# EAGLE board mainboard_eurobotics2010_r5 (EAGLE 4.16)
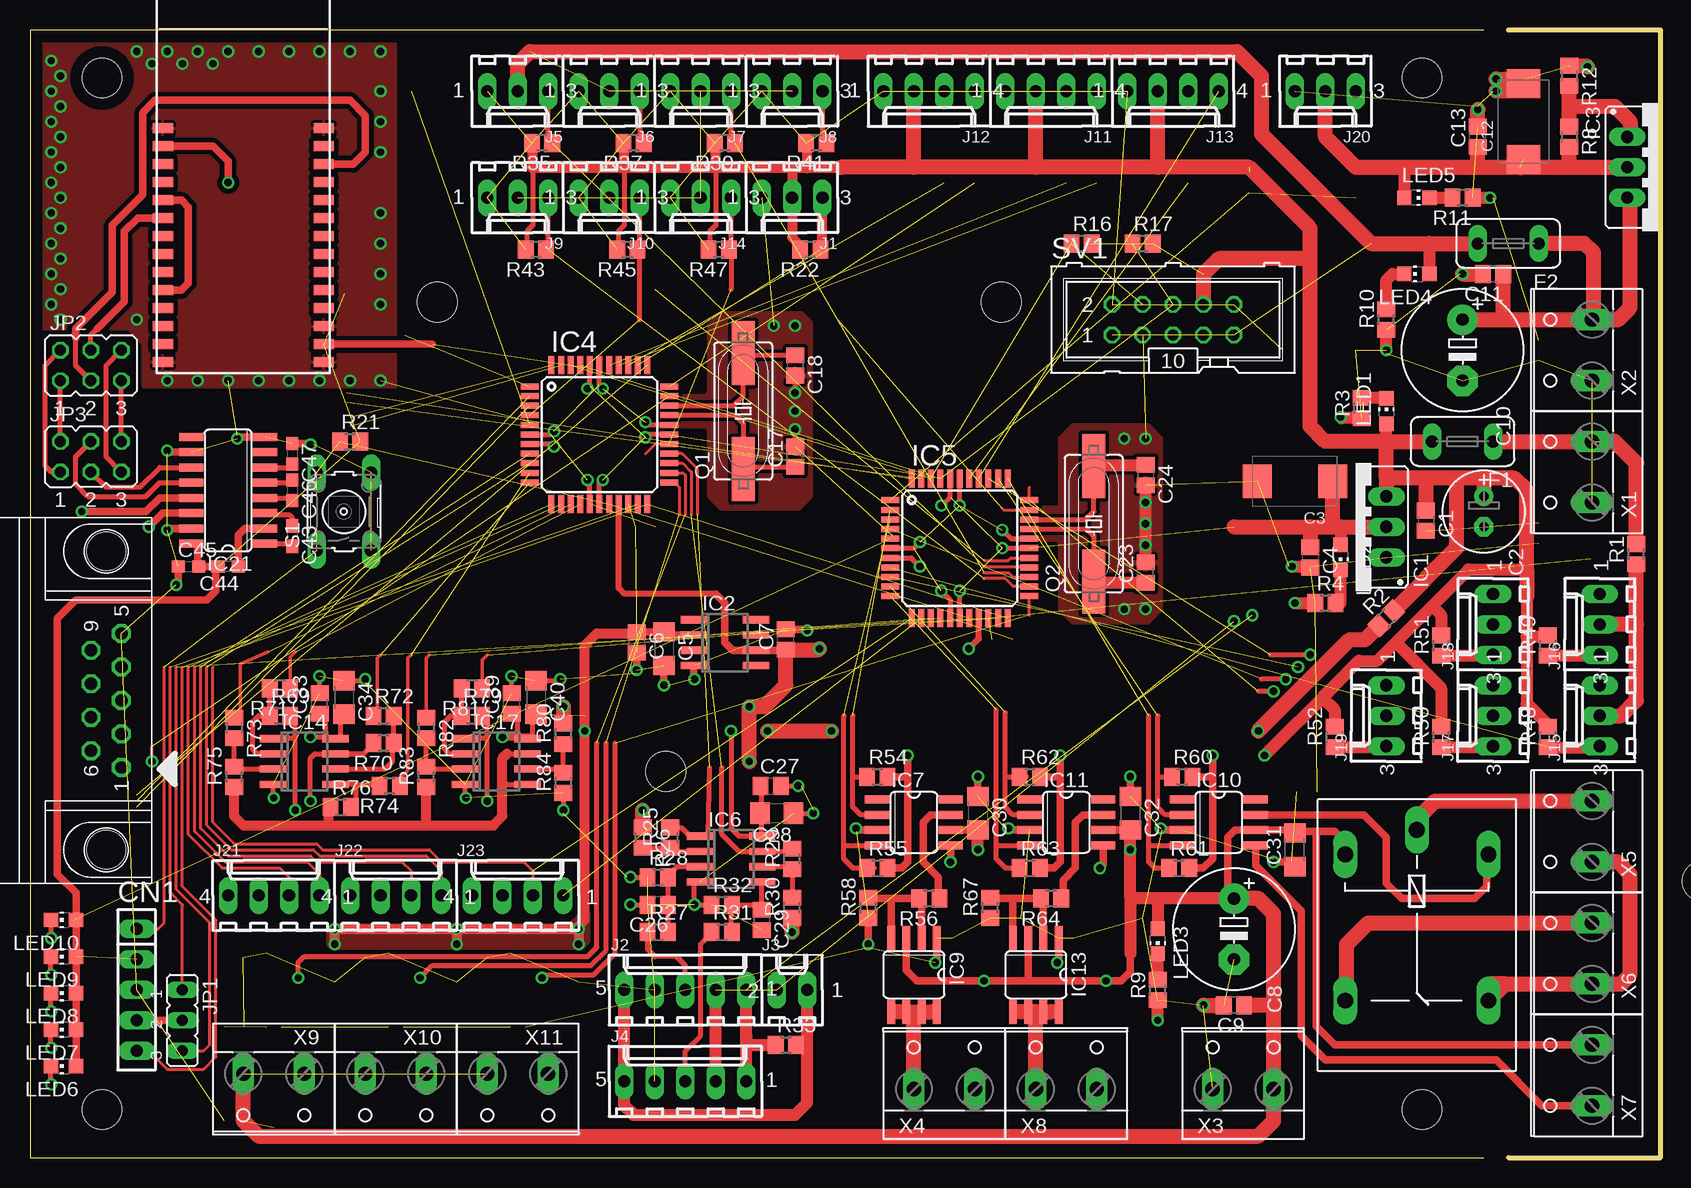
[diagram p9: board, top side]
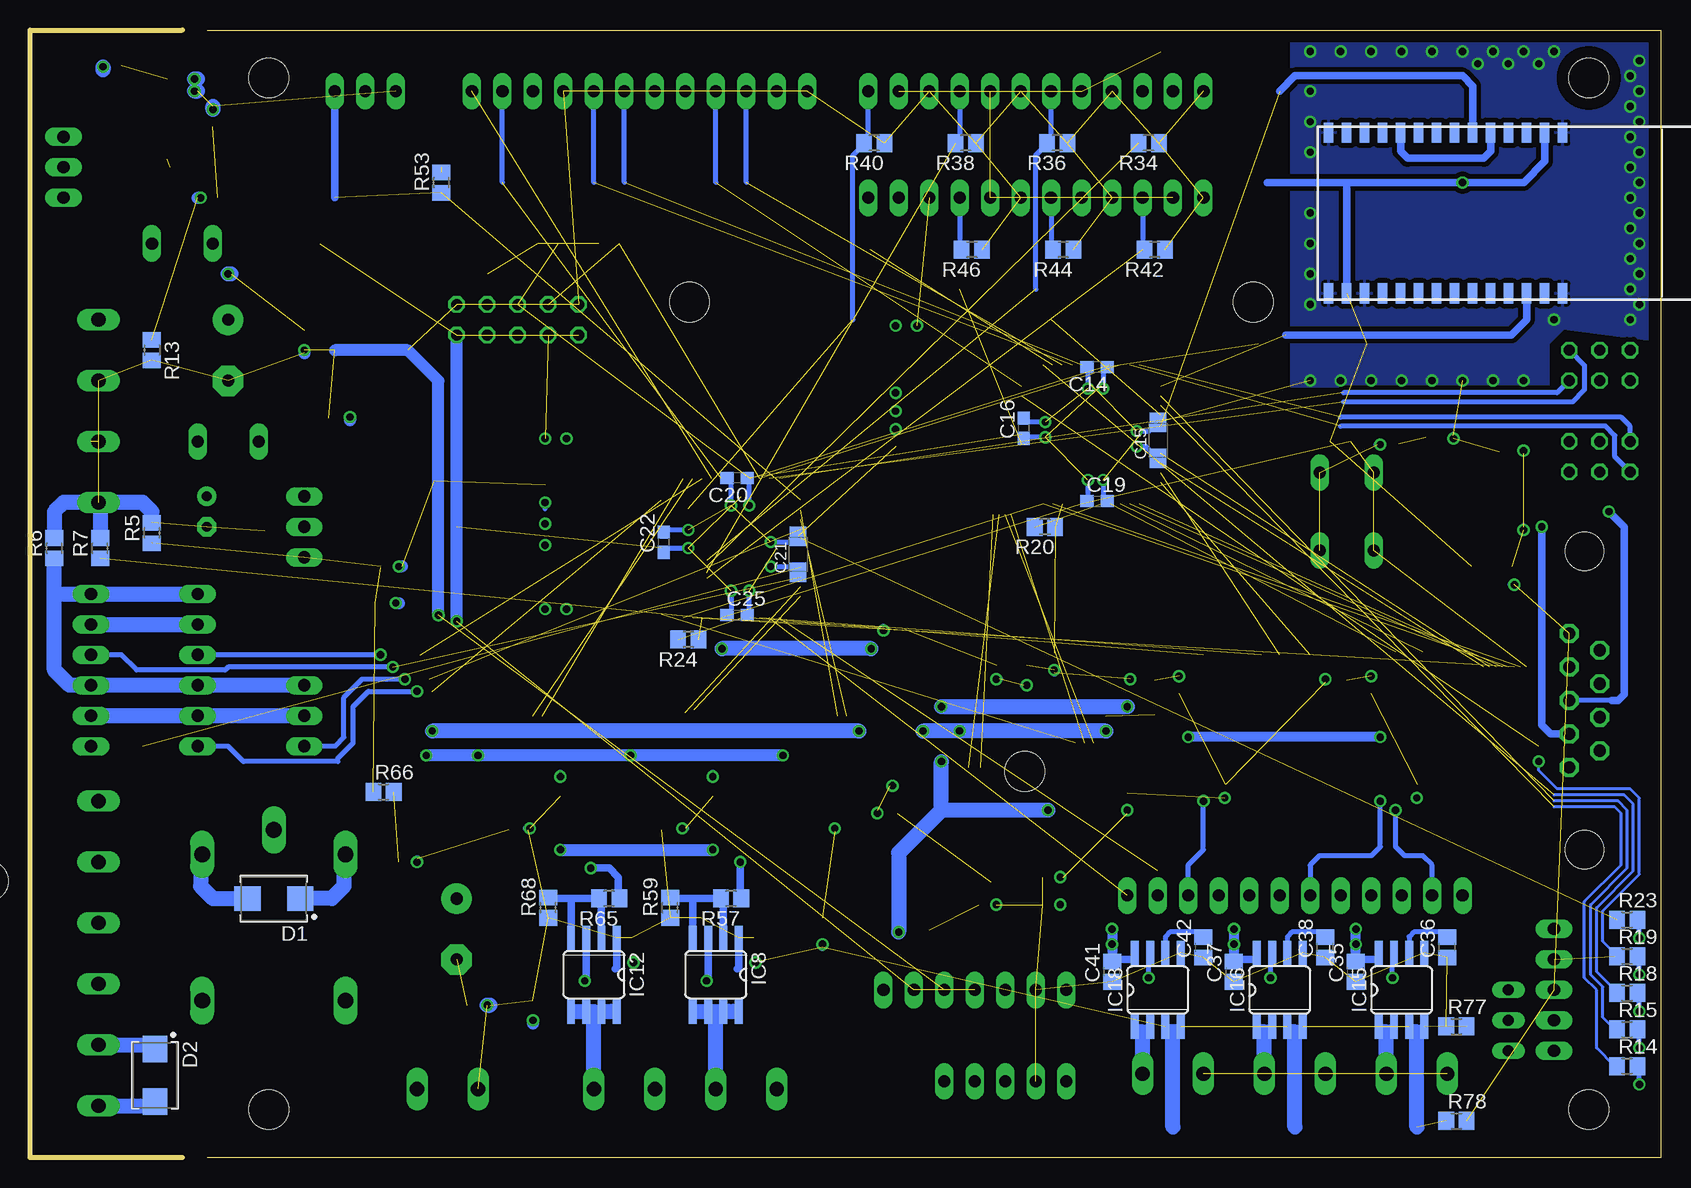
[diagram p10: board, bottom side, seen from below]

Size 135.89 x 94 mm. Coordinates in mm from the lower left corner, seen from the top.
Outline: 121.13,0 0,0 0,94 121.13,94
Outline: 123.19,0 135.89,0 135.89,93.98 123.19,93.98
Copper layers (1*16): Top 0.035mm / dielectric 1.5mm / Bottom 0.035mm
Design rules "olimex": minimum track width 10mil, minimum drill 24mil, track to track 8mil, track to pad 8mil, pad to pad 8mil, via to via 8mil, smd to smd 8mil, copper to edge 40mil, drill to drill 8mil, minimum pad ring 8mil, minimum via ring 8mil, stop-mask expansion 4mil, vias tented up to drill 0mil, thermal gap 10mil
Holes 3.3 mm at 6,4 116,4 6,90 116,90 80.93,71.31 33.94,71.31 52.99,32.19 139.35,23.05

## Footprints (pad centres in the part's own frame; a part is rotated, then mirrored left to right if it is on the bottom)
C0805 = smd 1.3 x 1.5: 1 -0.85,0; 2 0.85,0
E2,5-7 = drill 0.813 pad 1.6 round: + -1.27,0 | drill 0.813 pad 1.6 octagon: - 1.27,0
SMC_D = smd 2.4 x 2.8: + -3.15,0; - 3.15,0
C1206 = smd 1.6 x 1.8: 1 -1.4,0; 2 1.4,0
E5-10,5 = drill 1.016 pad 2.54 round: + -2.54,0 | drill 1.016 pad 2.54 octagon: - 2.54,0
C0603 = smd 1.1 x 1: 1 -0.85,0; 2 0.85,0
SMC_A = smd 1.6 x 1.4: + -1.5,0; - 1.5,0
SIP-100-5V = drill 1.016 long: 1 -5.08,0; 2 -2.54,0; 3 0,0; 4 2.54,0; 5 5.08,0
D-09F/90 = drill 1.016 pad 1.575 octagon: 1 -5.588,-1.27; 2 -2.794,-1.27; 3 0,-1.27; 4 2.794,-1.27; 5 5.588,-1.27; 6 -4.191,1.27; 7 -1.397,1.27; 8 1.397,1.27; 9 4.191,1.27 | hole 3.2: 12.446,0; -12.446,0
DIOM5436X265N = smd 2.2 x 2.05: A 2.2,0; K -2.2,0
TE5 = drill 1.016 long: 1 -2.54,0; 2 2.54,0
317TS = drill 1.016 long: 1 -2.54,-2.54; 2 0,-2.54; 3 2.54,-2.54
SOIC8 = smd 0.6 x 2.2: 1 -1.905,-2.6; 2 -0.635,-2.6; 3 0.635,-2.6; 4 1.905,-2.6; 5 1.905,2.6; 6 0.635,2.6; 7 -0.635,2.6; 8 -1.905,2.6
TQFP44 = smd 1.5 x 0.5: 1 -5.8,4; 2 -5.8,3.2; 3 -5.8,2.4; 4 -5.8,1.6; 5 -5.8,0.8; 6 -5.8,0; 7 -5.8,-0.8; 8 -5.8,-1.6; 9 -5.8,-2.4; 10 -5.8,-3.2; 11 -5.8,-4; 23 5.8,-4; 24 5.8,-3.2; 25 5.8,-2.4; 26 5.8,-1.6; 27 5.8,-0.8; 28 5.8,0; 29 5.8,0.8; 30 5.8,1.6; 31 5.8,2.4; 32 5.8,3.2; 33 5.8,4 | smd 0.5 x 1.5: 12 -4,-5.8; 13 -3.2,-5.8; 14 -2.4,-5.8; 15 -1.6,-5.8; 16 -0.8,-5.8; 17 0,-5.8; 18 0.8,-5.8; 19 1.6,-5.8; 20 2.4,-5.8; 21 3.2,-5.8; 22 4,-5.8; 34 4,5.8; 35 3.2,5.8; 36 2.4,5.8; 37 1.6,5.8; 38 0.8,5.8; 39 0,5.8; 40 -0.8,5.8; 41 -1.6,5.8; 42 -2.4,5.8; 43 -3.2,5.8; 44 -4,5.8
SO08 = smd 0.6 x 2.2: 1 -1.905,-2.6; 2 -0.635,-2.6; 3 0.635,-2.6; 4 1.905,-2.6; 5 1.905,2.6; 6 0.635,2.6; 7 -0.635,2.6; 8 -1.905,2.6
SO08' = smd 0.66 x 2.032: 1 -1.905,-3.073; 2 -0.635,-3.073; 3 0.635,-3.073; 4 1.905,-3.073; 5 1.905,3.073; 6 0.635,3.073; 7 -0.635,3.073; 8 -1.905,3.073
WT11 = smd 1.7 x 0.8: 1 -6.7,2.5; 2 -6.7,1; 3 -6.7,-0.5; 4 -6.7,-2; 5 -6.7,-3.5; 6 -6.7,-5; 7 -6.7,-6.5; 8 -6.7,-8; 9 -6.7,-9.5; 10 -6.7,-11; 11 -6.7,-12.5; 12 -6.7,-14; 13 -6.7,-15.5; 14 -6.7,-17; 15 6.7,-17; 16 6.7,-15.5; 17 6.7,-14; 18 6.7,-12.5; 19 6.7,-11; 20 6.7,-9.5; 21 6.7,-8; 22 6.7,-6.5; 23 6.7,-5; 24 6.7,-3.5; 25 6.7,-2; 26 6.7,-0.5; 27 6.7,1; 28 6.7,2.5
SO16 = smd 0.66 x 2.032: 1 -4.445,-3.073; 2 -3.175,-3.073; 3 -1.905,-3.073; 4 -0.635,-3.073; 5 0.635,-3.073; 6 1.905,-3.073; 7 3.175,-3.073; 8 4.445,-3.073; 9 4.445,3.073; 10 3.175,3.073; 11 1.905,3.073; 12 0.635,3.073; 13 -0.635,3.073; 14 -1.905,3.073; 15 -3.175,3.073; 16 -4.445,3.073
6410-03 = drill 1.016 long: 1 2.54,0; 2 0,0; 3 -2.54,0
6410-05 = drill 1.016 long: 1 5.08,0; 2 2.54,0; 3 0,0; 4 -2.54,0; 5 -5.08,0
6410-02 = drill 1.016 long: 1 1.27,0; 2 -1.27,0
6410-04 = drill 1.016 long: 1 3.81,0; 2 1.27,0; 3 -1.27,0; 4 -3.81,0
JP2 = drill 0.914 long: 1 -2.54,0; 2 0,0; 3 2.54,0
JP3Q = drill 0.914 octagon: 1 -2.54,-1.27; 2 -2.54,1.27; 3 0,-1.27; 4 0,1.27; 5 2.54,-1.27; 6 2.54,1.27
G5LE = drill 1.321 long: 1 -7.493,-5.969; 2 -7.493,5.969; O 4.699,5.969; P -9.525,0; S 4.699,-5.969
CHIP-LED0805 = smd 1.2 x 1.2: A 0,-1.05; C 0,1.05
HC49UP = smd 5.334 x 1.93: 1 -4.826,0; 2 4.826,0
R0805 = smd 1.3 x 1.5: 1 -0.85,0; 2 0.85,0
B3F-10XX = drill 1.016 long: 1 -3.251,2.261; 2 3.251,2.261; 3 -3.251,-2.261; 4 3.251,-2.261
ML10 = drill 0.914 octagon: 1 -5.08,-1.27; 2 -5.08,1.27; 3 -2.54,-1.27; 4 -2.54,1.27; 5 0,-1.27; 6 0,1.27; 7 2.54,-1.27; 8 2.54,1.27; 9 5.08,-1.27; 10 5.08,1.27
W237-132 = drill 1.194 long: 1 -2.54,-0.635; 2 2.54,-0.635

## Placement (x,y rotation side)
C1  100nF  [C0805]  116.33,53.09 270 top
C2  220uF/10V  [E2,5-7]  121.16,53.85 270 top
C3  47uF/6V  [SMC_D]  105.41,56.39 180 top
C4  100nF  [C0805]  106.68,50.04 270 top
C5  10uF/10V  [C1206]  52.83,42.42 270 top
C6  100nF  [C0805]  50.55,42.93 270 top
C7  100nF  [C0805]  62.99,43.18 90 top
C8  220uF/35V  [E5-10,5]  100.33,19.05 270 top
C9  100nF  [C0805]  100.33,12.7 180 top
C10  220uF/35V  [E5-10,5]  119.38,67.31 270 top
C11  100nF  [C0805]  121.92,73.66 180 top
C12  47uF/16V  [SMC_D]  124.46,86.36 90 top
C13  100nF  [C0805]  120.65,85.09 90 top
C14  100nF  [C0603]  46.96,65.89 180 bottom
C15  10uF/6V/lowESR  [SMC_A]  41.88,59.79 90 bottom
C16  100nF  [C0603]  53.06,60.81 90 bottom
C17  22pF  [C0805]  63.75,58.42 90 top
C18  22pF  [C0805]  63.75,66.04 270 top
C19  100nF  [C0603]  46.96,54.71 0 bottom
C20  100nF  [C0603]  76.96,56.64 180 bottom
C21  10uF/6V/lowESR  [SMC_A]  71.88,50.29 90 bottom
C22  100nF  [C0603]  83.06,51.31 90 bottom
C23  22pF  [C0805]  92.96,48.77 90 top
C24  22pF  [C0805]  92.96,56.9 270 top
C25  100nF  [C0603]  76.96,45.21 0 bottom
C26  C1  [C0805]  52.32,21.08 180 top
C27  100nF  [C0805]  61.72,30.99 0 top
C28  10uF/10V  [C1206]  62.23,28.7 180 top
C29  C1  [C0805]  60.96,19.81 270 top
C30  10uF/35V  [C1206]  78.99,28.7 270 top
C31  10uF/35V  [C1206]  105.41,25.65 90 top
C32  10uF/35V  [C1206]  91.69,28.7 270 top
C33  100nF  [C0805]  24.13,37.85 90 top
C34  10uF/10V  [C1206]  26.16,38.35 270 top
C35  100nF  [C0805]  25.4,15.49 90 bottom
C36  100nF  [C0805]  17.78,17.53 90 bottom
C37  100nF  [C0805]  35.56,15.49 90 bottom
C38  100nF  [C0805]  27.94,17.53 90 bottom
C39  100nF  [C0805]  40.13,37.85 90 top
C40  10uF/10V  [C1206]  42.16,38.35 270 top
C41  100nF  [C0805]  45.72,15.49 90 bottom
C42  100nF  [C0805]  38.1,17.53 90 bottom
C43  100nF  [C0603]  21.84,51.82 270 top
C44  100nF  [C0603]  16.51,49.28 180 top
C45  100nF  [C0603]  13.21,49.28 0 top
C46  100nF  [C0603]  21.84,55.63 270 top
C47  100nF  [C0603]  21.84,58.67 270 top
CN1  [SIP-100-5V]  8.89,13.97 270 top
CON1  [D-09F/90]  6.35,38.1 90 top
D1  SS24  [DIOM5436X265N]  115.57,21.59 180 bottom
D2  SS24  [DIOM5436X265N]  125.48,6.86 270 bottom
F1  FUSETE5  [TE5]  119.38,59.69 180 top
F2  FUSETE5  [TE5]  123.19,76.2 180 top
IC1  LM1086CT-3.3  [317TS]  110.49,52.58 90 top
IC2  ADR443BRZ-R-8  [SOIC8]  57.91,42.93 270 top
IC3  LM338T  [317TS]  135.64,82.55 270 top
IC4  DSPIC33FJXXMC804SMD  [TQFP44]  47.45,60.28 0 top
IC5  DSPIC33FJXXMC804SMD  [TQFP44]  77.47,50.8 0 top
IC6  MCP6022SN  [SO08]  58.42,24.89 270 top
IC7  TC4427  [SO08']  73.66,27.94 270 top
IC8  IRF7389  [SO08']  78.74,15.24 180 bottom
IC9  IRF7389  [SO08']  73.66,15.24 180 top
IC10  TC4427  [SO08']  99.06,27.94 270 top
IC11  TC4427  [SO08']  86.36,27.94 270 top
IC12  IRF7389  [SO08']  88.9,15.24 180 bottom
IC13  IRF7389  [SO08']  83.82,15.24 180 top
IC14  MCP6022SN  [SO08]  22.86,33.02 270 top
IC15  ADS713  [SO08']  21.59,13.97 0 bottom
IC16  ADS713  [SO08']  31.75,13.97 0 bottom
IC17  MCP6022SN  [SO08]  38.86,33.02 270 top
IC18  ADS713  [SO08']  41.91,13.97 0 bottom
IC19  WT11A  [WT11]  17.78,83.31 0 top
IC20  WT11A  [WT11]  10.67,78.74 270 bottom
IC21  MAX232ACSE  [SO16]  16.51,55.63 90 top
J1  [6410-03]  63.5,80.01 180 top
J2  [6410-05]  54.61,13.97 0 top
J3  [6410-02]  63.5,13.97 0 top
J4  [6410-05]  54.61,6.35 0 top
J5  [6410-03]  40.64,88.9 180 top
J6  [6410-03]  48.26,88.9 180 top
J7  [6410-03]  55.88,88.9 180 top
J8  [6410-03]  63.5,88.9 180 top
J9  [6410-03]  40.64,80.01 180 top
J10  [6410-03]  48.26,80.01 180 top
J11  [6410-04]  85.09,88.9 180 top
J12  [6410-04]  74.93,88.9 180 top
J13  [6410-04]  95.25,88.9 180 top
J14  [6410-03]  55.88,80.01 180 top
J15  [6410-03]  130.81,36.83 90 top
J16  [6410-03]  130.81,44.45 90 top
J17  [6410-03]  121.92,36.83 90 top
J18  [6410-03]  121.92,44.45 90 top
J19  [6410-03]  113.03,36.83 90 top
J20  [6410-03]  107.95,88.9 180 top
J21  [6410-04]  20.32,21.84 0 top
J22  [6410-04]  30.48,21.84 0 top
J23  [6410-04]  40.64,21.84 0 top
JP1  [JP2]  12.7,11.43 270 top
JP2  [JP3Q]  5.08,66.04 0 top
JP3  [JP3Q]  5.08,58.42 0 top
K1  G5LE  [G5LE]  115.57,17.78 270 top
LED1  [CHIP-LED0805]  113.03,62.23 0 top
LED2  [CHIP-LED0805]  109.22,50.04 180 top
LED3  [CHIP-LED0805]  93.98,18.03 180 top
LED4  [CHIP-LED0805]  115.57,73.66 90 top
LED5  [CHIP-LED0805]  115.57,80.01 270 top
LED6  [CHIP-LED0805]  2.79,7.62 90 top
LED7  [CHIP-LED0805]  2.79,10.67 90 top
LED8  [CHIP-LED0805]  2.79,13.72 90 top
LED9  [CHIP-LED0805]  2.79,16.76 90 top
LED10  [CHIP-LED0805]  2.79,19.81 90 top
Q1  10MHz  [HC49UP]  59.44,62.23 90 top
Q2  10MHz  [HC49UP]  88.65,52.83 90 top
R1  0R  [R0805]  133.86,50.29 90 top
R2  0R  [R0805]  113.03,44.96 45 top
R3  470R  [R0805]  111,62.48 90 top
R4  270R  [R0805]  107.95,46.23 0 top
R5  0R  [R0805]  125.73,52.07 90 bottom
R6  0R  [R0805]  133.86,50.8 90 bottom
R7  0R  [R0805]  130.05,50.8 90 bottom
R8  240R/1%  [R0805]  128.27,85.09 270 top
R9  2K7  [R0805]  93.98,13.97 90 top
R10  1K  [R0805]  113.03,69.85 90 top
R11  1K  [R0805]  119.38,80.01 180 top
R12  1K6/1%  [R0805]  128.27,90.17 270 top
R13  0R  [R0805]  125.73,67.31 270 bottom
R14  270R  [R0805]  2.79,7.62 0 bottom
R15  270R  [R0805]  2.79,10.67 0 bottom
R16  4K7  [R0805]  87.63,76.2 0 top
R17  4K7  [R0805]  92.71,76.2 0 top
R18  270R  [R0805]  2.79,13.72 0 bottom
R19  270R  [R0805]  2.79,16.76 0 bottom
R20  0R  [R0805]  51.31,52.58 180 bottom
R21  10K  [R0805]  26.67,59.69 0 top
R22  4K7  [R0805]  65.02,75.69 180 top
R23  270R  [R0805]  2.79,19.81 0 bottom
R24  0R  [R0805]  81.03,43.18 180 bottom
R25  RD  [R0805]  53.34,26.67 90 top
R26  RC  [R0805]  51.05,26.67 270 top
R27  RA  [R0805]  52.32,18.8 0 top
R28  RB  [R0805]  52.32,23.37 0 top
R29  RD  [R0805]  63.5,24.89 90 top
R30  RC  [R0805]  63.5,20.83 90 top
R31  RA  [R0805]  57.66,18.8 0 top
R32  RB  [R0805]  57.66,21.08 0 top
R33  10K  [R0805]  62.99,9.4 0 top
R34  4K7  [R0805]  42.67,84.58 180 bottom
R35  4K7  [R0805]  42.67,84.58 180 top
R36  4K7  [R0805]  50.29,84.58 180 bottom
R37  4K7  [R0805]  50.29,84.58 180 top
R38  4K7  [R0805]  57.91,84.58 180 bottom
R39  4K7  [R0805]  57.91,84.58 180 top
R40  4K7  [R0805]  65.53,84.58 180 bottom
R41  4K7  [R0805]  65.53,84.58 180 top
R42  4K7  [R0805]  42.16,75.69 180 bottom
R43  4K7  [R0805]  42.16,75.69 180 top
R44  4K7  [R0805]  49.78,75.69 180 bottom
R45  4K7  [R0805]  49.78,75.69 180 top
R46  4K7  [R0805]  57.4,75.69 180 bottom
R47  4K7  [R0805]  57.4,75.69 180 top
R48  4K7  [R0805]  126.49,35.05 90 top
R49  4K7  [R0805]  126.49,42.67 90 top
R50  4K7  [R0805]  117.6,35.05 90 top
R51  4K7  [R0805]  117.6,42.67 90 top
R52  4K7  [R0805]  108.71,35.05 90 top
R53  4K7  [R0805]  101.6,81.28 90 bottom
R54  2K2  [R0805]  70.61,31.75 0 top
R55  2K2  [R0805]  70.61,24.13 0 top
R56  22R  [R0805]  74.93,21.59 180 top
R57  22R  [R0805]  77.47,21.59 180 bottom
R58  2K2  [R0805]  69.85,20.83 90 top
R59  2K2  [R0805]  82.55,20.83 90 bottom
R60  2K2  [R0805]  96.01,31.75 0 top
R61  2K2  [R0805]  95.76,24.13 0 top
R62  2K2  [R0805]  83.31,31.75 0 top
R63  2K2  [R0805]  83.31,24.13 0 top
R64  22R  [R0805]  85.09,21.59 180 top
R65  22R  [R0805]  87.63,21.59 180 bottom
R66  0R  [R0805]  106.43,30.48 0 bottom
R67  2K2  [R0805]  80.01,20.83 90 top
R68  2K2  [R0805]  92.71,20.83 90 bottom
R69  2K/1%  [R0805]  20.83,36.83 0 top
R70  2K/1%  [R0805]  29.46,34.54 180 top
R71  1K/1%  [R0805]  20.83,39.12 180 top
R72  1K/1%  [R0805]  29.46,36.83 0 top
R73  1K/1%  [R0805]  17.02,35.81 270 top
R74  1K/1%  [R0805]  29.97,30.99 180 top
R75  2K/1%  [R0805]  17.02,31.75 90 top
R76  2K/1%  [R0805]  25.91,29.21 0 top
R77  0R  [R0805]  17.02,10.92 0 bottom
R78  0R  [R0805]  17.02,3.05 0 bottom
R79  2K/1%  [R0805]  36.83,36.83 0 top
R80  1K/1%  [R0805]  44.45,35.31 90 top
R81  1K/1%  [R0805]  36.83,39.12 180 top
R82  1K/1%  [R0805]  33.02,35.81 270 top
R83  2K/1%  [R0805]  33.02,31.75 90 top
R84  2K/1%  [R0805]  44.45,31.24 90 top
S1  [B3F-10XX]  26.16,53.85 90 top
SV1  [ML10]  95.25,69.85 0 top
X1  [W237-132]  129.54,57.15 90 top
X2  [W237-132]  129.54,67.31 90 top
X3  [W237-132]  101.09,6.35 0 top
X4  [W237-132]  76.2,6.35 0 top
X5  [W237-132]  129.54,27.18 90 top
X6  [W237-132]  129.54,17.02 90 top
X7  [W237-132]  129.54,6.86 90 top
X8  [W237-132]  86.36,6.35 0 top
X9  [W237-132]  20.32,6.35 180 top
X10  [W237-132]  30.48,6.35 180 top
X11  [W237-132]  40.64,6.35 180 top

## Tracks (layer width: path | path; a pad name or v marks a point on that pad's centre or on a via)
0V  (via drill 0.61)  (23 unrouted)
  Top 0.406: 68.96,27.3 v68.83,27.43
  Top 0.61: IC10.3 94.36,27.3 v94.23,27.43 | IC9.1 75.56,16.38 v75.44,16.26 | v69.85,17.78 R58.1 | C31.1 105.41,24.38 105.16,24.64 v103.63,24.64 | C32.1 v91.69,31.75 | IC13.1 85.72,16.38 v85.6,16.26 | C30.1 v78.99,31.75 | IC11.3 81.41,27.3 v81.53,27.43 | IC7.3 68.96,27.3
  Top 1.016: v93.98,11.43 R9.1
  Top 1.27: v97.79,12.7 C9.2
  Bottom 0.406: IC15.4 19.79,10.9 19.81,10.92 19.84,10.9 IC15.3 20.34,10.9 20.32,10.92 20.32,10.16 | IC18.3 40.16,10.9 40.13,10.92 40.11,10.9 IC18.4 40.62,10.9 40.64,10.92 40.64,10.16 | IC16.4 30.96,10.9 30.99,10.92 31.01,10.9 IC16.3 30.5,10.9 30.48,10.92 30.48,10.16 | v68.83,27.43 68.83,27.18
  Bottom 0.61: v94.23,27.43 94.49,27.43 | IC8.1 76.83,15.88 76.96,15.75 | 69.85,17.53 v69.85,17.78 | v103.63,24.64 103.63,24.89 | v91.69,31.75 91.69,32 | IC12.1 87,15.88 87.12,15.75 | v78.99,31.75 78.99,32 | v81.53,27.43 81.28,27.43
  Bottom 1.016: v93.98,11.43 93.98,11.18
  Bottom 1.27: v97.79,12.7 97.54,12.7 | 20.32,2.54 20.32,10.16 | 40.64,2.54 40.64,10.16 | 30.48,2.54 30.48,10.16
+3V3  (via drill 0.61)  (11 unrouted)
  Top 0.254: 3.84,22.06 3.81,22.1
  Top 0.305: LED7.A 3.81,10.67 3.84,10.63 | LED8.A 3.81,13.72 3.84,13.68 | LED9.A 3.81,16.76 3.84,16.73 | LED10.A 3.81,19.81 3.84,19.78
  Top 0.406: 77.47,44.96 IC5.17 v77.47,47.24 | v81.03,50.8 IC5.28 | IC5.40 76.67,55.08 v75.95,54.36 | IC4.17 47.45,56.22 v47.72,56.49 | IC4.28 51.55,60.28 v51.28,60.04 | IC4.40 46.65,64.31 v46.45,64.11
  Top 0.61: 13.97,49.28 C45.2 | IC21.16 13.97,51.18 13.97,49.28 | 13.97,49.28 C44.2 15.75,49.28 15.49,49.02 15.49,47.24 14.73,46.48 3.81,46.48 2.29,44.96 2.29,23.62 3.81,22.1 | LED6.A 3.84,10.63 | LED7.A 3.84,13.68 | LED8.A 3.84,16.73 | LED9.A 3.84,19.78 | LED10.A 3.84,22.06 | IC19.2 15.26,84.31 16.51,83.06 v16.51,81.28 | IC19.16 33.52,67.81 33.53,67.82
  Top 1.016: 109.22,52.58 LED2.A
  Top 1.27: 100.33,52.58 106.68,52.58 | 106.68,52.58 108.46,52.58 | 108.46,52.58 109.22,52.58 IC1.2 | C3.+ 108.56,52.68 108.46,52.58 | 106.68,52.58 C4.1
  Bottom 0.254: 47.72,54.71 C19.1 | 53.06,60.04 C16.1
  Bottom 0.406: C25.1 77.47,45.21 v77.47,47.24 | C22.1 83.06,50.8 v81.03,50.8 | C20.1 75.95,56.64 v75.95,54.36 | v47.72,56.49 47.72,54.71 | v51.28,60.04 53.06,60.04 | C14.1 46.2,65.89 46.45,65.63 v46.45,64.11
  Bottom 0.61: 26.16,81.28 v16.51,81.28 11.43,81.28 9.67,83.04 IC20.2 | 26.16,81.28 32.77,81.28 | IC20.16 26.17,81.27 26.16,81.28
+3V_VREF  (via drill 0.61)
  Top 0.508: IC5.19 79.07,43.26 v78.23,42.42 | IC4.19 49.05,47.47 49.53,46.99 57.15,46.99
  Top 0.61: C7.1 62.99,42.16 62.87,42.29 IC2.6 58.55,42.29 57.91,42.93 57.91,46.23 57.15,46.99
  Top 1.27: 62.99,42.16 62.99,39.37 61.21,37.59 v59.94,37.59 v59.94,33.02 | v63.5,18.8 R30.1 | R26.1 v51.05,28.96 | v44.45,37.59 R80.2 | C7.1 65.7,42.33 v65.79,42.42
  Bottom 1.27: v63.5,18.8 63.5,25.4 59.94,28.96 | v51.05,28.96 59.94,28.96 | 59.94,28.96 v59.94,33.02 | v59.94,37.59 v44.45,37.59 | v65.79,42.42 v78.23,42.42
+5V  (via drill 0.61)  (3 unrouted)
  Top 0.406: 41.91,82.55 41.91,77.72 41.4,77.22 41.4,75.69 R43.2 | 49.53,82.55 49.53,77.72 49.02,77.22 49.02,75.69 R45.2 | 57.15,82.55 57.15,77.72 56.64,77.22 56.64,75.69 R47.2
  Top 0.61: R61.2 97.79,24.13 98.55,24.89 98.55,31.75 | 98.55,31.75 R60.2 | 71.88,31.75 R54.2 73.15,31.75 | 85.85,31.75 R62.2 | 73.15,31.75 v73.15,33.53 | v85.85,33.53 85.85,31.75 | v98.55,33.53 98.55,31.75 | R63.2 85.34,24.13 85.85,24.64 85.85,31.75 | R55.2 72.64,24.13 73.15,24.64 73.15,31.75
  Top 0.813: 41.91,82.55 41.91,84.58 | 49.53,82.55 49.53,84.58 | 64.77,82.55 64.77,84.58 | R39.2 57.15,84.58 57.15,82.55 | 63.5,82.55 J1.2 63.5,76.71 64.17,76.03 R22.2
  Top 1.016: R50.2 117.6,39.12 113.79,42.93 | 108.71,39.37 107.7,38.35 108.71,37.34 R52.2 | 108.71,39.37 110.74,41.4 112.27,41.4 113.79,42.93 | R48.2 126.49,36.07 124.71,37.85 124.71,43.43 | 124.71,46.74 124.71,43.43 | R49.2 126.49,43.43 124.71,43.43 | 117.6,43.43 R51.2 117.6,45.21 116.84,45.97 | 116.84,45.97 113.79,42.93 | 116.84,45.97 119.89,49.02 124.71,49.02 | 113.03,59.69 LED1.A | 41.91,84.58 R35.2 | 41.91,82.55 49.53,82.55 57.15,82.55 63.5,82.55 64.77,82.55 67.56,82.55 | 49.53,84.58 R37.2 | 64.77,84.58 R41.2 | v102.87,33.53 108.71,39.37
  Top 1.27: 113.03,59.69 107.95,59.69 106.68,60.96 106.68,74.93 | 113.03,59.69 F1.2 | 113.03,56.64 113.03,59.69 | 113.03,56.64 IC1.3 | 121.16,56.64 C2.+ | 116.33,56.64 113.03,56.64 | 116.33,56.64 C1.1 | R2.2 118.87,50.8 118.87,56.64 | 118.87,56.64 116.33,56.64 | 121.16,56.64 118.87,56.64 | 124.71,46.74 124.71,49.02 124.71,55.63 123.7,56.64 121.16,56.64 | 106.68,74.93 106.68,77.47 101.6,82.55 93.98,82.55 | 83.82,82.55 73.66,82.55 | 93.98,82.55 83.82,82.55 | 73.66,82.55 67.56,82.55 | 93.98,82.55 J13.2 | 73.66,82.55 J12.2 | 83.82,82.55 J11.2 | SV1.8 97.79,73.66 99.06,74.93 106.68,74.93
  Bottom 1.016: v73.15,33.53 v85.85,33.53 v98.55,33.53 v102.87,33.53
+5V_ANALOG  (via drill 0.61)  (1 unrouted)
  Top 0.406: 60.96,28.7 60.96,26.8 IC6.8 59.05,26.8 58.42,27.43 v58.42,35.56 | C27.1 60.96,30.99 60.96,28.7 | 60.96,28.7 C28.2 | 25.91,35.05 25.78,34.92 IC14.8 24.77,34.92 24.64,35.05 24.64,36.58 24.22,37 C33.1 | 25.91,35.05 25.91,36.58 26.16,36.83 C34.2 26.03,36.95 25.91,36.83 25.91,35.05 | C39.1 40.22,37 40.64,36.58 40.64,35.05 40.77,34.92 IC17.8 41.78,34.92 41.91,35.05 41.91,36.32 | 41.91,36.32 41.91,36.58 42.16,36.83 C40.2 42.16,36.58 41.91,36.32 | v23.37,35.05 25.91,35.05
  Top 0.61: v39.37,35.05 41.91,35.05 | IC2.2 53.21,43.56 52.83,43.94 C5.1 50.68,43.82 50.55,43.69
  Top 0.813: v25.4,17.78 v25.4,19.05 v35.56,19.05 | v35.56,19.05 v35.56,17.78 | v35.56,19.05 v35.56,17.78 | v35.56,19.05 v35.56,17.78 | v45.72,19.05 v45.72,17.78 | v45.72,19.05 v45.72,17.78 | v35.56,19.05 v35.56,17.78 | v45.72,19.05 v45.72,17.78 | v45.72,19.05 v45.72,17.78 | v45.72,19.05 45.72,19.3 46.23,19.81 v46.23,35.56 46.23,36.83 46.23,42.67 47.24,43.69 50.55,43.69 C6.1 | v35.56,19.05 v45.72,19.05
  Top 1.27: R2.1 111.25,43.18 109.98,43.18 v102.36,35.56 | v61.47,35.56 v66.8,35.56
  Bottom 0.61: IC15.8 23.5,16.64 23.62,16.51 25.4,16.51 | IC16.8 33.66,16.64 33.78,16.51 35.56,16.51 | IC18.8 43.81,16.64 43.94,16.51 45.72,16.51
  Bottom 0.813: C35.2 25.4,16.51 v25.4,17.78 v25.4,19.05 | C37.2 35.56,16.51 v35.56,17.78 v35.56,19.05 | C41.2 45.72,16.51 v45.72,17.78 v45.72,19.05 | v23.37,35.05 v39.37,35.05
  Bottom 1.27: v46.23,35.56 v58.42,35.56 v61.47,35.56 | v66.8,35.56 v102.36,35.56
  pour Top: 46.48,20.32 46.48,18.03 45.97,17.53 25.15,17.53 24.89,17.78 24.89,19.05 25.15,19.3 44.96,19.3 45.97,20.32
+12V  (via drill 0.61)  (10 unrouted)
  Top 1.016: LED4.A 116.62,76.17 116.59,76.2 | J4.2 J2.2
  Top 1.27: F2.2 116.59,76.2 111.76,76.2 102.62,85.34 102.62,90.17 100.58,92.2 41.66,92.2 40.64,91.19 J5.2
  Bottom 1.016: v100.33,44.7 SV1.9
+24V  (via drill 0.61)  (2 unrouted)
  Top 0.61: C8.+ 99.82,22.1 99.82,26.67 100.46,27.3 IC10.6 105.28,27.3 105.41,27.18 | 105.92,26.67 105.53,27.05 C31.2 105.41,27.18 | K1.1 109.6,26.29 108.71,27.18 107.19,27.18 | 105.41,27.18 107.19,27.18 | 107.19,27.18 107.19,10.92 108.71,9.4 X7.2 130.3,9.4 | C32.2 | C32.2 IC11.6 | C32.2 91.69,27.43 | C30.2 78.99,27.43 78.87,27.3 IC7.6 | IC9.3 73.03,15.62 73.91,14.73 v79.5,14.73 83.31,14.73 | 83.31,14.73 v89.66,14.73 90.93,14.73 91.69,15.49 91.69,17.02 | IC13.3 83.19,14.86 83.31,14.73
  Top 1.016: C8.+ 93.98,21.59 | 93.98,21.59 91.69,21.59 | C32.2 v91.69,25.65 91.69,21.59 | 93.98,21.59 LED3.A | v78.99,25.65 C30.2 | 91.69,21.59 91.69,17.02
  Top 1.27: 103.63,12.7 103.63,20.32 102.36,21.59 C8.+ | 103.63,12.7 C9.1 | 103.63,5.84 103.63,12.7 | X9.2 17.78,3.05 19.05,1.78 102.36,1.78 103.63,3.05 103.63,5.84 | 103.63,5.84 X3.2
  Bottom 0.61: IC8.3 79.38,14.86 v79.5,14.73 | IC12.3 89.53,14.86 v89.66,14.73
  Bottom 1.016: v91.69,25.65 v78.99,25.65
  Bottom 1.27: D1.K 110.74,21.59 109.73,22.61 109.73,25.15 K1.1 | D2.K 125.48,9.4 X7.2
AGND  (via drill 0.61)  (33 unrouted)
  Top 0.406: C27.2 v64.01,30.99 | C28.1 v65.28,28.7 | v50.04,23.37 R28.1 | v50.04,21.08 C26.2 | R32.1 v55.37,21.08 55.37,22.86 55.5,22.99 IC6.4 | IC17.4 36.26,30.03 v36.32,29.97 | IC14.4 20.26,30.03 v20.32,29.97 | C39.2 v40.13,40.13 | C40.1 44.07,39.75 v44.2,39.88 | C34.1 27.82,39.75 v27.94,39.88 | C33.2 v24.13,40.13 | R84.1 v44.45,28.96
  Top 0.61: IC2.4 55.31,39.94 v55.37,39.88 | v52.83,39.37 C5.2 | v50.55,40.64 C6.2 | C7.2 64.68,44.03 v64.77,43.94
  Bottom 0.406: v64.01,30.99 64.26,30.99 | v65.28,28.7 65.28,28.96 | v50.04,23.37 49.78,23.37 | v50.04,21.08 49.78,21.08 | v55.37,21.08 55.37,21.34 | v36.32,29.97 36.07,29.97 | 20.07,29.97 v20.32,29.97 | v40.13,40.13 40.13,40.39 | v44.2,39.88 44.2,39.62 | v27.94,39.88 27.94,39.62 | v24.13,40.13 24.13,40.39 | v44.45,28.96 44.45,28.7
  Bottom 0.61: v55.37,39.88 55.12,39.88 | v52.83,39.37 53.09,39.37 | 50.55,40.39 v50.55,40.64 | v64.77,43.94 64.77,44.2
ARM_ENC_CHA  (1 unrouted)
  Bottom 0.406: 96.52,81.28 J13.3
ARM_ENC_CHB  (1 unrouted)
ARM_MOT_BREAK  (1 unrouted)
ARM_MOT_CURRENT  (via drill 0.61)  (1 unrouted)
  Top 0.254: IC5.23 83.27,45.25 83.31,45.21
  Top 0.406: v42.67,14.99 42.93,15.24 46.99,15.24 48.77,17.02 48.77,34.54
  Bottom 0.406: IC18.7 42.55,16.38 42.67,16.26 v42.67,14.99
ARM_MOT_REV  (1 unrouted)
  Top 0.254: J23.2 41.91,23.88 41.15,24.64 34.29,24.64 33.27,25.65 24.38,25.65 23.88,26.16 17.02,26.16 15.24,27.94 15.24,40.89
ARM_MOT_VREF_N  (1 unrouted)
  Top 0.305: R81.1 37.68,41.49 38.1,41.91
ARM_MOT_VREF_P  (1 unrouted)
  Top 0.305: R82.1 33.02,41.66 33.27,41.91
ARM_VREF  (via drill 0.61)
  Top 0.406: R79.2 37.59,36.83 38.1,36.32 38.1,35.05 | IC17.1 37.97,34.92 38.1,35.05 | v38.1,29.72 38.1,35.05
  Bottom 0.406: v38.1,29.72 38.1,25.65 39.37,24.38 J23.3
BEACON_UART_RX  (1 unrouted)
  Bottom 0.61: IC20.26 11.17,69.86 12.45,68.58 31.24,68.58
BEACON_UART_TX  (1 unrouted)
  Bottom 0.61: IC20.6 15.67,89.33 16.51,90.17 30.48,90.17 31.75,88.9
COMPRESSOR_POWER  (1 unrouted)
  Top 0.406: IC10.2 94.61,28.57 93.98,29.21 93.98,31.75 | 93.98,31.75 93.98,36.83 | 93.98,31.75 R60.1
CORN_INSIDE_SENSOR  (1 unrouted)
  Top 0.254: IC5.25 81.9,48.4 81.53,48.77 79.5,48.77
  Top 0.406: R39.1 58.42,84.58 J7.3
  Bottom 0.406: R39.1 58.42,84.58 J7.3
CORN_PUSH_PWM_(5V)  (via drill 0.61)  (1 unrouted)
  Top 0.406: R52.1 108.71,34.29 | v104.65,39.88 102.62,39.88
  Top 1.016: R52.1 112.94,34.2 J19.3
  Bottom 0.406: J19.3 110.49,34.29 109.73,35.05 109.73,38.35 108.2,39.88 v104.65,39.88
FROM_TX_RS232_M  (via drill 0.61)
  Top 0.61: IC21.13 10.79,54.99 9.65,53.85 v4.32,53.85
  Bottom 0.406: 4.06,38.1 CON1.3
  Bottom 0.61: v4.32,53.85 3.05,52.58 3.05,38.61 3.56,38.1 4.06,38.1
G_RST  (5 unrouted)
  Top 0.254: CN1.1 10.67,19.05 11.18,19.56 11.18,40.89
GND  (via drill 0.61)  (30 unrouted)
  Top 0.406: v11.43,58.93 11.56,58.8 | IC5.16 76.67,46.52 v75.95,47.24 | IC5.29 81.75,51.6 v81.03,52.32 | v77.47,54.36 IC5.39 | IC5.6 73.66,50.8 v74.17,51.31 | IC4.16 46.65,56.29 v46.45,56.49 | IC4.29 51.51,61.08 v51.28,61.31 | IC4.6 43.39,60.28 v43.66,60.55 | IC4.39 47.45,64.38 v47.72,64.11 | C17.2 v63.75,60.71 | C18.2 v63.75,63.75
  Top 0.61: 11.56,58.8 IC21.10 | C47.1 23.28,59.52 v23.37,59.44 | IC21.8 17.4,60.07 v17.27,59.94 | C45.1 12.36,47.92 v12.19,47.75 | IC21.15 11.56,52.45 v11.43,52.32
  Top 1.016: v105.41,46.23 R4.1 | C4.2 106.68,49.28 v105.16,49.28 | C23.2 v92.96,51.05 v92.96,54.61 C24.2
  Bottom 0.254: 46.45,54.71 C19.2 | 53.06,61.31 C16.2
  Bottom 0.406: v11.43,58.93 11.43,58.67 | C25.2 75.95,45.21 v75.95,47.24 | C22.2 83.06,52.32 v81.03,52.32 | C20.2 77.47,56.64 v77.47,54.36 | C21.- 71.88,51.31 v74.17,51.31 | v92.96,54.61 92.96,54.1 | v92.96,51.05 92.96,51.31 | v46.45,56.49 46.45,54.71 | v51.28,61.31 53.06,61.31 | C15.- 42.64,60.55 v43.66,60.55 | C14.2 47.72,65.89 v47.72,64.11 | v63.75,63.75 63.75,63.5
  Bottom 0.61: v23.37,59.44 23.62,59.44 | v17.27,59.94 17.27,60.2 | v12.19,47.75 12.45,47.75 | v11.43,52.32 11.43,52.58
  Bottom 1.016: v105.41,46.23 105.16,46.23 | v105.16,49.28 104.9,49.28
  other vias: 2.54,69.85 1.78,71.12 2.54,72.39 1.78,73.66 2.54,74.93 1.78,76.2 2.54,77.47 1.78,78.74 2.54,80.01 1.78,81.28 2.54,82.55 1.78,83.82 2.54,85.09 1.78,86.36 2.54,87.63 1.78,88.9 2.54,90.17 1.78,91.44 8.89,92.2 10.16,91.19 11.43,92.2 12.7,91.19 13.97,92.2 15.24,91.19 16.51,92.2 19.05,92.2 21.59,92.2 24.13,92.2 26.67,92.2 29.21,92.2 29.21,88.9 29.21,86.36 29.21,83.82 29.21,78.74 29.21,76.2 29.21,73.66 29.21,71.12 29.21,64.77 26.67,64.77 24.13,64.77 21.59,64.77 19.05,64.77 16.51,64.77 13.97,64.77 11.43,64.77 8.89,69.85 92.96,45.72 92.96,59.94 63.75,69.34 63.75,62.23 61.98,69.34 91.19,59.94 91.19,45.72 92.96,52.83
  pour Top (isolate 0.406): -2.54,69.09 8.13,69.09 9.4,67.82 9.4,64.26 30.48,64.26 30.48,93.98 0,93.98
  pour Bottom (isolate 0.406): -1.78,67.82 8.13,69.09 9.4,67.82 9.4,64.26 30.73,64.26 30.73,93.98 -0.51,93.98
  pour Top (isolate 0.305): 83.06,51.56 85.6,51.56 85.85,51.31 85.85,45.72 86.87,44.7 93.22,44.7 94.23,45.72 94.23,59.94 93.22,60.96 86.87,60.96 85.85,59.94 85.85,54.1 83.06,54.1
  pour Top (isolate 0.305): 53.09,63.5 56.39,63.5 56.64,63.75 56.64,69.34 57.66,70.36 64.26,70.36 65.02,69.6 65.02,55.12 64.01,54.1 57.66,54.1 56.64,55.12 56.64,60.71 56.39,60.96 53.09,60.96
GND_SERVO_5V
  Bottom 1.27: 133.86,46.99 133.86,40.64 132.59,39.37 J15.1 J17.1 J19.1 | 133.86,46.99 R6.1 | 133.86,46.99 J16.1 J18.1
GND_SERVO_9.6V  (via drill 0.61)  (5 unrouted)
  Top 1.016: R11.1 v121.67,80.01
  Top 1.27: R12.1 129.71,91.02 v129.79,90.93 | C13.2 v120.65,87.38 | v122.17,88.9 124.46,88.9 C12.- 124.46,89.92 v122.17,89.92
  Bottom 1.016: v121.67,80.01 121.92,80.01
  Bottom 1.27: v129.79,90.93 129.79,90.68 | v120.65,87.38 120.65,87.63 | v122.17,88.9 121.92,88.9 | v122.17,89.92 121.92,89.92
GNDIO  (via drill 0.61)  (29 unrouted)
  Top 1.016: v113.03,67.31 R10.1 | R33.1 59.69,9.4 59.69,10.16 | 59.69,10.16 J2.1 | J4.1 59.69,10.16 | R3.1 109.31,61.63 v109.22,61.72
  Top 1.27: v119.38,73.66 C11.2
  Bottom 1.016: v113.03,67.31 113.03,67.06 | v109.22,61.72 109.22,61.47 | v101.85,45.21 101.85,64.77 104.39,67.31 110.49,67.31
  Bottom 1.27: 119.13,73.66 v119.38,73.66 | 130.05,54.61 R7.2 | R5.2 125.73,53.85 126.49,54.61 130.05,54.61 | 130.05,54.61 X1.1 133.1,54.61 133.86,53.85 R6.2
I2C_SCL_(5V)  (3 unrouted)
I2C_SDA_(5V)  (3 unrouted)
L_BALL_IN_SENSOR  (1 unrouted)
  Top 0.254: IC5.27 81.75,50 81.53,49.78 79.5,49.78
  Top 0.406: R37.1 50.8,84.58 J6.3
  Bottom 0.406: 52.07,72.39 52.07,83.57 51.14,84.49 R37.1 50.8,84.58 J6.3
L_BALLS_LID_PWM_(5V)  (via drill 0.61)  (1 unrouted)
  Top 0.254: 70.75,48.4 IC5.9
  Top 0.406: R49.1 126.49,41.91
  Top 1.016: R49.1 130.72,41.82 J16.3
  Bottom 0.406: J16.3 128.27,41.91 127,40.64 119.63,40.64 119.38,40.89 v105.66,40.89
L_CORN_HOLD_PWM_(5V)  (via drill 0.61)  (1 unrouted)
  Top 0.406: R51.1 117.6,41.91 | v106.68,41.91 103.38,41.91
  Top 1.016: R51.1 121.83,41.82 J18.3
  Bottom 0.406: v106.68,41.91 J18.3
L_CORN_MOT_INA_(5V)  (1 unrouted)
  Top 0.406: IC11.2 81.92,28.57 81.28,29.21 81.28,31.75 | 81.28,31.75 81.28,37.08 | 83.06,31.75 R62.1 81.28,31.75
L_CORN_MOT_INB_(5V)  (1 unrouted)
  Top 0.406: R63.1 81.28,24.13 80.52,24.89 80.52,26.16 | 80.52,26.16 80.52,37.34 | IC11.4 80.64,26.04 80.52,26.16
L_ENC_CHA  (1 unrouted)
  Bottom 0.406: 76.2,81.28 J12.3
L_ENC_CHB  (1 unrouted)
  Bottom 0.406: 78.74,81.28 J12.4
L_MOT_BREAK  (1 unrouted)
  Top 0.254: J21.1 24.13,23.62 23.11,24.64 16.26,24.64 13.72,27.18 13.72,40.89
L_MOT_CURRENT  (via drill 0.61)  (1 unrouted)
  Top 0.254: IC4.24 54.43,57.08 54.61,56.9 54.61,53.59
  Top 0.406: 47.24,34.54 47.24,17.53 46.48,16.76 22.86,16.76 22.35,16.26 v22.35,14.99
  Bottom 0.406: IC15.7 22.23,16.13 22.35,16 v22.35,14.99
L_MOT_REV  (1 unrouted)
  Top 0.254: J21.2 21.59,23.37 20.83,24.13 16,24.13 13.21,26.92 13.21,40.89
L_MOT_VREF  (via drill 0.61)
  Top 0.406: R69.2 21.84,36.83 22.1,36.58 22.1,35.05 | IC14.1 21.97,34.92 22.1,35.05 | v22.1,28.96 22.1,35.05
  Bottom 0.406: v22.1,28.96 22.1,25.91 21.34,25.15 19.81,25.15 19.05,24.38 J21.3
L_MOT_VREF_N  (1 unrouted)
  Top 0.305: R71.1 21.68,41.74 22.1,42.16
L_MOT_VREF_P  (1 unrouted)
  Top 0.305: R73.1 17.11,36.66 17.53,37.08 17.53,41.15 19.81,42.16
L_WALL_SENSOR  (1 unrouted)
  Top 0.406: 50.8,69.85 50.8,75.69 | 50.8,75.69 R45.1 | 50.8,75.69 J10.3
  Bottom 0.406: 50.8,75.69 R45.1 50.63,76.03 50.8,76.2 J10.3
LASER_BALL_SCAN  (1 unrouted)
  Top 0.254: IC4.26 54.35,58.68 55.63,57.4 55.63,53.59
  Top 0.406: 56.64,32.51 56.52,26.8 IC6.1 54.99,26.8 54.27,27.52 R25.2
LASER_CORN_SCAN  (1 unrouted)
  Top 0.254: IC4.25 54.39,57.88 55.12,57.15 55.12,53.59
  Top 0.406: 63.5,25.53 IC6.7 59.05,25.53 57.66,26.92 57.66,32.51
  Top 0.61: 63.5,25.53 R29.2
MAIN_LED1  (1 unrouted)
  Bottom 0.254: R18.1 3.64,13.8 5.33,15.49 5.33,20.83 2.29,23.88 2.29,29.46 3.05,30.23 8.89,30.23
MAIN_LED2  (via drill 0.61)  (1 unrouted)
  Top 0.254: v10.16,33.02 10.16,34.29
  Bottom 0.254: R19.1 3.64,16.85 4.83,18.03 4.83,20.57 1.78,23.62 1.78,29.97 2.54,30.73 8.64,30.73 10.16,32.26 v10.16,33.02
MAIN_LED3  (1 unrouted)
  Bottom 0.254: R15.1 3.81,10.67 4.83,11.68 4.83,14.22 5.84,15.24 5.84,21.08 2.79,24.13 2.79,28.96 3.56,29.72 8.89,29.72
MAIN_LED4  (1 unrouted)
  Bottom 0.254: R14.1 3.81,7.62 5.33,9.14 5.33,13.97 6.35,14.99 6.35,21.34 3.3,24.38 3.3,28.7 3.81,29.21 8.89,29.21
MAIN_PGED  (1 unrouted)
  Top 0.254: JP1.1 12.7,21.08 11.68,22.1 11.68,40.89
MAIN_UART_RX  (1 unrouted)
  Top 0.406: JP3.2 JP2.1 JP3.2
  Bottom 0.406: JP3.2 2.54,60.96 3.3,61.72 26.67,61.72
MAIN_UART_TX  (1 unrouted)
  Top 0.406: JP2.2 1.27,66.04 1.27,57.66 1.78,57.15 JP3.1
  Bottom 0.406: 26.67,60.96 4.57,60.96 3.81,60.2 3.81,58.42 JP3.1
N$1  (via drill 0.61)
  Top 0.406: LED10.C 1.74,18.25 v1.78,18.29
  Bottom 0.406: R23.2 1.78,19.81 v1.78,18.29
N$2
  Bottom 0.61: 77.22,12.19 77.19,12.17 IC8.8 | 77.98,12.19 77.72,12.19 | 80.64,12.06 IC8.5 80.29,12.17 80.26,12.19 80.24,12.17 | IC8.6 79.27,12.17 79.25,12.19 79.22,12.17 78.72,12.17
  Bottom 1.27: 78.72,12.17 78.51,12.17 | 78.51,12.17 IC8.7 | 78.51,12.17 77.98,12.19 | 78.72,12.17 78.74,11.94 X4.2 | 77.72,12.19 77.22,12.19 | 78.72,12.17 IC8.6 80.24,12.17
N$3
  Top 1.27: R8.1 128.27,87.63 | IC3.1 133.35,85.09 133.35,86.36 132.08,87.63 128.27,87.63 | 128.27,87.63 R12.2
N$4
  Top 0.61: IC9.8 75.46,12.17 75.44,12.19 75.16,12.17 | IC9.6 73.13,12.17 73.15,12.19 73.18,12.17 73.64,12.17 73.66,11.94 | IC9.5 71.86,12.17 71.88,12.19 72.16,12.17 | X4.1 73.66,5.59
  Top 1.27: 75.16,12.17 IC9.7 73.18,12.17 72.16,12.17 | X4.1 73.66,11.94
N$5
  Top 0.406: R27.1 51.47,17.36 52.07,16.76 53.85,16.76 54.61,16 J2.3
N$6
  Bottom 0.61: 80.77,21.59 R57.2 78.23,21.59 78.11,21.46 IC8.2 | R59.2 82.55,21.59 80.77,21.59 | IC8.4 80.64,21.46 80.77,21.59
N$7
  Top 0.61: IC9.2 74.3,21.46 74.17,21.59 | 74.17,21.59 R56.2 | R58.2 69.85,21.59 71.88,21.59 | 71.88,21.59 74.17,21.59 | IC9.4 71.75,21.46 71.88,21.59
N$8  (via drill 0.61)
  Top 0.406: LED8.C 1.74,12.16 v1.78,12.19
  Bottom 0.406: R18.2 1.78,13.72 v1.78,12.19
N$10  (via drill 0.61)
  Top 0.406: LED9.C 1.74,15.21 v1.78,15.24
  Bottom 0.406: R19.2 1.78,16.76 v1.78,15.24
N$11  (via drill 0.61)
  Top 0.406: LED7.C 1.74,9.11 v1.78,9.14
  Bottom 0.406: R15.2 1.78,10.67 v1.78,9.14
N$12
  Top 1.016: LED5.C R11.2
N$13  (via drill 0.61)
  Top 0.406: LED6.C 1.74,6.06 v1.78,6.1
  Bottom 0.406: R14.2 1.78,7.62 v1.78,6.1
N$14
  Top 0.61: IC7.7 75.06,28.57 74.42,27.94 74.42,24.64 75.69,23.37 75.69,21.84 75.78,21.76 R56.1
N$15  (via drill 0.61)
  Top 0.61: IC7.5 76.73,24.66 v76.71,24.64
  Bottom 0.61: 76.71,21.59 R57.1 76.62,21.76 76.71,21.84 v76.71,24.64
N$16
  Bottom 0.61: IC20.5 14.17,83.88 14.73,83.31 21.08,83.31 21.67,83.9 IC20.10
N$17
  Bottom 0.61: IC12.6 89.64,12.17 89.66,12.19 89.69,12.17 | IC12.7 88.16,12.17 88.14,12.19 | 87.38,12.19 87.1,12.17 IC12.8 | IC12.5 90.45,12.17 90.42,12.19 90.4,12.17
  Bottom 1.27: 88.9,12.17 88.16,12.17 | 88.9,12.17 IC12.6 | 88.14,12.19 87.38,12.19 | 89.69,12.17 90.4,12.17 | X8.2 88.9,12.17
N$18
  Top 0.61: IC13.7 84.35,12.17 84.33,12.19 | IC13.6 83.08,12.17 83.06,12.19 | IC13.5 82.02,12.17 82.04,12.19 82.32,12.17 | IC13.8 85.57,12.17 85.34,12.19 85.11,12.17 | 83.82,12.17 83.82,12.19
  Top 1.27: 83.82,12.17 IC13.6 82.32,12.17 | 83.82,12.17 IC13.7 85.11,12.17 | X8.1 83.82,12.17
N$19
  Bottom 0.61: IC12.4 90.81,21.46 90.68,21.59 90.17,21.59 | 90.17,21.59 R65.2 88.39,21.59 88.27,21.46 IC12.2 | R68.2 92.71,21.59 90.17,21.59
N$20
  Top 0.61: IC13.2 84.45,21.46 84.33,21.59 | IC13.4 81.92,21.46 82.04,21.59 | 84.33,21.59 R64.2 | 82.04,21.59 84.33,21.59 | R67.2 80.18,21.68 80.26,21.59 82.04,21.59
N$21
  Top 0.61: IC11.7 87.76,28.57 87.12,27.94 87.12,24.13 86.11,23.11 86.11,21.84 85.94,21.68 R64.1
N$22  (via drill 0.61)
  Top 0.61: IC11.5 89.43,24.41 v89.15,24.13
  Bottom 0.61: v89.15,24.13 87.63,24.13 86.87,23.37 86.87,21.59 R65.1
N$23
  Top 0.61: IC10.7 111.12,28.57 113.03,26.67 113.03,22.86 114.3,21.59 120.4,21.59 121.41,22.61 121.41,25.15 K1.2
  Bottom 1.27: D1.A 120.65,21.59 121.67,22.61 121.67,24.89 121.41,25.15 K1.2
N$24
  Top 1.27: K1.O 121.67,13.21 122.94,14.48 | 122.94,14.48 121.67,14.48 | 122.94,14.48 X6.1 132.59,14.48 133.35,15.24 133.35,23.62 132.33,24.64 X5.1 130.05,24.64
N$26
  Top 1.27: K1.P 115.57,28.19 117.09,29.72 X5.2
N$27
  Top 0.406: C43.2 21.84,51.05 21.72,51.18 IC21.1
N$30
  Top 0.406: IC21.3 20.19,53.72 20.32,53.59 21.59,53.59 21.84,53.34 C43.1
N$31
  Top 0.406: C46.2 21.84,54.86 21.72,54.99 IC21.4
N$32
  Top 0.406: C46.1 21.84,56.39 21.72,56.26 IC21.5
N$33
  Top 0.61: C44.1 17.36,51.9 17.91,52.45 IC21.2
N$34
  Top 0.406: C47.2 21.84,57.66 21.72,57.53 IC21.6
N$35
  Top 1.27: X6.2 111.51,19.56 109.73,17.78 109.73,13.21 K1.S 109.47,12.95
N$36
  Top 0.406: IC6.2 53.72,25.53 53.43,25.82 R25.1 51.14,25.82 51.05,25.91 | 51.05,25.91 50.8,26.16 | R26.2 51.05,25.91
N$38
  Top 0.61: 130.3,4.32 X7.1 125.98,4.32 122.17,8.13 107.95,8.13 105.92,10.16 105.92,20.57 102.13,24.36 IC10.5
  Bottom 1.27: D2.A 125.64,4.66 125.98,4.32 X7.1
N$40
  Top 0.406: R28.2 53.59,23.37 53.59,23.88 | R28.2 53.17,23.46 53.98,24.26 IC6.3 | R28.2 53.17,21.25 53.34,21.08 C26.1 53.17,18.71 | R27.2 53.17,18.71 | 53.17,18.71 53.34,18.54
N$43
  Top 1.27: IC3.3 133.35,80.01 133.35,70.87 132.33,69.85 130.3,69.85 | C10.+ 122.68,69.85 | 122.68,69.85 X2.2 130.3,69.85 | F2.1 129.54,76.2 130.3,75.44 130.3,69.85 | C11.1 122.77,69.94 122.68,69.85
N$47
  Top 0.406: IC4.31 58.62,62.68 59.44,63.5 Q1.2 59.6,66.89 C18.1
N$48
  Top 0.406: IC4.30 58.77,61.88 59.44,61.21 59.44,57.66 | 59.44,57.66 Q1.1 | C17.1 59.52,57.57 59.44,57.66
N$49  (via drill 0.61)
  Top 0.406: IC4.7 43.46,59.48 v43.66,59.28
  Bottom 0.406: 41.88,58.27 C15.+ 42.9,59.28 v43.66,59.28
N$50
  Top 0.406: IC5.31 88,53.2 88.65,53.85 Q2.2 88.73,57.75
  Top 1.016: 88.73,57.75 C24.1
N$51
  Top 0.406: IC5.30 88.06,52.4 88.65,51.82 Q2.1 88.73,47.92
  Top 1.016: 88.73,47.92 C23.1
N$52  (via drill 0.61)
  Top 0.406: IC5.7 73.44,50 v74.17,49.28
  Bottom 0.406: C21.+ 71.88,49.28 v74.17,49.28
N$61
  Top 0.406: IC14.2 18.92,33.66 18.54,34.04 18.54,36.32 19.05,36.83 R69.1 20.07,36.83 19.98,36.92 R71.2
N$64
  Top 1.016: LED1.C 113.03,63.25 112.94,63.33 R3.2
N$65
  Top 1.016: R4.2 109.22,46.23 LED2.C
N$66
  Top 1.016: LED4.C 113.54,73.66 113.03,73.15 R10.2
N$67
  Top 1.016: R9.2 LED3.C
N$70
  Top 0.406: IC14.3 17.14,32.38 17.02,32.51 R75.2 R73.2 17.02,35.05
N$71
  Top 0.406: IC14.6 29.59,32.38 30.23,33.02 30.23,34.54 R70.1 30.31,36.66 30.48,36.83 R72.2
N$72
  Bottom 0.406: 23.6,10.9 IC15.1 | 22.86,10.9 IC15.2 | 22.86,10.9 23.6,10.9 | 23.6,10.9 23.62,10.92 | 22.86,10.16 22.86,10.9
  Bottom 1.27: X9.1 22.86,10.16
N$73
  Bottom 0.406: IC15.6 20.95,18.41 20.57,18.8 18.03,18.8 17.78,18.54 C36.2
N$74
  Top 0.406: 28.96,30.99 28.7,30.99 29.12,31.15 | 28.96,30.99 R74.2 | 27.18,31.11 IC14.5 | 27.18,31.11 28.83,31.11 28.96,30.99 | R76.2 27.18,29.21 27.18,31.11
N$75
  Top 0.406: IC17.6 44.07,32.38 44.45,32 R84.2 R80.1 44.45,34.54
N$76
  Bottom 0.406: IC16.1 33.55,10.9 33.53,10.92 33.5,10.9 | 33.5,10.9 IC16.2 | 33.5,10.9 33.05,10.9 33.02,10.92 33.02,10.16
  Bottom 1.27: X10.1 33.02,10.16
N$77
  Bottom 0.406: IC16.6 31.11,18.41 30.73,18.8 28.45,18.8 27.94,18.29 C38.2
N$78
  Bottom 0.406: IC18.1 43.71,10.9 43.69,10.92 43.66,10.9 | 43.66,10.9 IC18.2 | 43.66,10.9 43.2,10.9 43.18,10.92 43.18,10.16
  Bottom 1.27: 43.18,6.86 X11.1 43.18,10.16
N$79
  Bottom 0.406: C42.2 38.1,18.29 38.61,18.8 40.89,18.8 41.27,18.41 IC18.6
N$83
  Top 0.406: IC17.2 34.92,33.66 34.54,34.04 34.54,36.32 35.05,36.83 35.81,36.83 | 36.07,36.83 R79.1 35.81,36.83 | R81.2 35.98,37 35.81,36.83
N$84
  Top 0.406: R83.2 33.02,32.77 33.4,32.38 IC17.3 | R83.2 33.02,32.51 | R83.2 R82.2
N$92
  Top 1.016: 64.77,9.4 R33.2 | 64.77,9.4 J3.1 | J2.5 J4.5 49.53,4.32 50.29,3.56 63.75,3.56 64.77,4.57 64.77,9.4
N$93
  Top 0.61: IC19.10 12.62,72.31 13.21,72.9 13.21,79.25 12.64,79.81 IC19.5
N$94
  Top 0.406: IC6.6 63.5,24.26 | R29.1 R30.2
  Top 0.61: 63.5,24.26 R29.1
N$95
  Top 0.406: 60.96,21.08 C29.1 | 60.96,21.08 R32.2 58.42,21.08 58.42,18.8 R31.2 | IC6.5 60.96,22.99 60.96,21.08
N$96
  Top 0.406: J4.3 54.61,8.89 55.88,10.16 55.88,17.78 56.9,18.8 R31.1
N$112  (1 unrouted)
  Top 1.27: F1.1 X1.2 | R1.2 133.86,57.91 132.08,59.69 130.81,59.69
PGEC  (2 unrouted)
  Top 0.254: CN1.5 9.91,8.89 11.43,7.37 14.48,7.37 15.49,8.38 15.49,19.81 12.7,22.61 12.7,40.89
PGED
  Top 0.61: CN1.4 JP1.2
R_BALL_IN_SENSOR  (2 unrouted)
  Top 0.254: IC5.26 82.88,49.2 82.8,49.28 79.5,49.28
  Top 0.406: R35.1 43.18,84.58 J5.3
R_BALLS_LID_PWM_(5V)  (1 unrouted)
  Top 0.406: R48.1 126.49,34.29
  Top 1.016: R48.1 130.72,34.2 J15.3
R_CORN_HOLD_PWM_(5V)  (via drill 0.61)  (1 unrouted)
  Top 0.254: IC5.33 83.27,55.84 83.31,55.88
  Top 0.406: R50.1 117.6,34.29 | v103.63,38.86 102.36,38.86
  Top 1.016: R50.1 121.83,34.2 J17.3
  Bottom 0.406: J17.3 119.38,34.29 118.11,33.02 110.24,33.02 110.24,33.27 108.97,34.54 108.97,37.59 107.7,38.86 v103.63,38.86
R_CORN_MOT_INA_(5V)  (1 unrouted)
  Top 0.406: IC7.2 69.22,28.57 68.58,29.21 68.58,31.75 | 68.58,31.75 68.58,36.83 | 68.58,31.75 R54.1
R_CORN_MOT_INB_(5V)  (1 unrouted)
  Top 0.406: 67.82,26.16 67.82,24.89 68.58,24.13 R55.1 70.36,24.13 | IC7.4 67.94,26.04 67.82,26.16 | 67.82,26.16 67.82,36.83
R_ENC_CHA  (1 unrouted)
  Bottom 0.406: 86.36,81.28 J11.3
R_ENC_CHB  (1 unrouted)
  Bottom 0.406: 88.9,81.28 J11.4
R_MOT_BREAK  (1 unrouted)
  Top 0.254: J22.1 34.29,23.88 33.02,25.15 24.13,25.15 23.62,25.65 16.76,25.65 14.73,27.69 14.73,40.89
R_MOT_CURRENT  (via drill 0.61)  (1 unrouted)
  Top 0.254: 53.7,56.28 54.1,55.88 54.1,53.59
  Top 0.406: v32.51,14.99 33.53,16 46.74,16 48.01,17.27 48.01,34.54 | IC4.23 53.7,56.28
  Bottom 0.406: IC16.7 32.38,16.38 32.51,16.26 v32.51,14.99
R_MOT_REV  (1 unrouted)
  Top 0.254: J22.2 31.75,23.88 30.99,24.64 23.88,24.64 23.37,25.15 16.51,25.15 14.22,27.43 14.22,40.89
R_MOT_VREF  (via drill 0.61)
  Top 0.406: R70.2 28.7,34.54 27.81,33.66 | 27.81,33.66 IC14.7 | 27.81,33.66 23.75,33.66 23.37,33.27 v23.37,29.72
  Bottom 0.406: J22.3 29.21,24.38 28.45,25.15 24.13,25.15 23.37,25.91 v23.37,29.72
R_MOT_VREF_N  (1 unrouted)
  Top 0.305: 28.96,37.34 28.96,41.66 29.21,41.91
  Top 0.406: R72.1 28.61,37 28.96,37.34
R_MOT_VREF_P  (1 unrouted)
  Top 0.305: 31.75,41.91 31.5,41.66 31.5,32.26 30.73,31.5
  Top 0.406: R74.1 30.73,31.5
R_WALL_SENSOR  (1 unrouted)
  Top 0.254: IC4.27 52.11,59.48 51.31,58.67
  Top 0.406: 58.42,75.69 58.42,72.39 | R47.1 58.42,75.69 | 58.42,75.69 J14.3
  Bottom 0.406: 58.42,75.69 R47.1 58.25,76.03 58.42,76.2 J14.3
RX_MAX232
  Top 0.406: JP3.4 3.81,58.42 3.81,56.13 4.83,55.12 9.65,55.12 10.79,56.26 IC21.12
RX_WT11
  Top 0.406: 5.59,69.09 5.08,68.58 JP2.4
  Top 0.61: IC19.6 8.97,78.31 7.87,77.22 7.87,71.37 5.59,69.09
SERVOS_UART_(5V)  (2 unrouted)
  Bottom 0.61: 110.49,80.01 J20.3
SLAVE_LED1  (1 unrouted)
SLAVE_PGED  (1 unrouted)
  Top 0.254: JP1.3 14.48,8.89 14.99,9.4 14.99,19.56 12.19,22.35 12.19,40.89
SLAVE_UART_RX  (1 unrouted)
  Top 0.406: JP3.6 JP2.5 JP3.6
  Bottom 0.406: JP2.5 8.64,63.75 26.42,63.75
SLAVE_UART_TX  (1 unrouted)
  Top 0.406: JP3.5 6.35,58.42 6.35,66.04 JP2.6
  Bottom 0.406: 26.42,62.99 7.37,62.99 6.35,64.01 6.35,66.04 JP2.6
START  (1 unrouted)
  Top 0.813: R22.1 65.87,75.78 66.04,75.95 J1.3
SUCKER_OBJ_SENSOR  (1 unrouted)
  Top 0.254: IC5.24 81.94,47.6 81.28,48.26 79.5,48.26
  Top 0.406: R43.1 43.01,76.03 43.18,76.2 J9.3
  Bottom 0.406: R43.1 43.18,75.69 J9.3
TO_RX_RS232_M  (via drill 0.61)
  Top 0.61: IC21.14 11.05,53.72 v9.91,52.58
  Bottom 0.61: v9.91,52.58 9.91,36.07 9.14,35.31 CON1.2
TX_MAX232
  Top 0.406: IC21.11 10.79,57.53 9.14,55.88 6.35,55.88 JP3.3
TX_WT11
  Top 0.406: JP2.3 3.81,66.04 3.81,68.33
  Top 0.61: 3.81,68.33 3.81,69.09 6.86,72.14 6.86,77.72 9.4,80.26 9.4,87.12 10.41,88.14 26.67,88.14 27.94,86.87 27.94,83.82 26.93,82.81 IC19.26
VACUUM_REV  (1 unrouted)
  Top 0.406: R61.1 93.73,24.13 93.22,24.64 93.22,26.16 | 93.22,26.16 93.22,36.83 | IC10.4 93.34,26.04 93.22,26.16
VACUUM_SENSOR  (1 unrouted)
  Top 0.254: IC5.32 81.13,54 81.03,54.1
  Top 0.406: R41.1 66.04,84.58 J8.3
  Bottom 0.406: 67.31,69.85 67.31,83.57 66.38,84.49 R41.1 66.04,84.58 J8.3
VCC_SERVO_5V
  Top 1.27: 133.86,44.45 133.86,38.1 132.59,36.83 J15.2 | 133.86,44.45 R1.1 | 133.86,44.45 J16.2
  Bottom 1.27: J16.2 J18.2 | J15.2 J17.2 J19.2
VCC_SERVO_9.6V  (1 unrouted)
  Top 1.016: LED5.A 114.52,82.52 114.55,82.55
  Top 1.27: 120.65,82.55 124.21,82.55 | 124.21,82.55 128.27,82.55 | 128.27,82.55 IC3.2 | 124.21,82.55 124.24,82.52 | 128.27,82.55 R8.2 | 120.65,82.55 C13.1 | 120.65,82.55 114.55,82.55 110.49,82.55 107.95,85.09 J20.2
VOFF_2V
  Top 0.406: 39.75,33.66 IC17.7 | IC17.5 39.75,31.11 39.37,31.24
  Top 0.61: R83.1 33.11,30.9 33.27,30.73
  Top 0.813: 39.75,33.66 39.37,33.27 39.37,31.24 39.37,28.45 38.61,27.69 33.02,27.69 | R75.1 17.02,28.45 17.78,27.69 24.89,27.69 | 24.89,27.69 33.02,27.69 | 33.27,30.73 33.02,30.73 33.02,27.69 | R76.1 24.89,29.21 24.89,27.69